# EAGLE design amiga-akab (EAGLE 7.5.0)
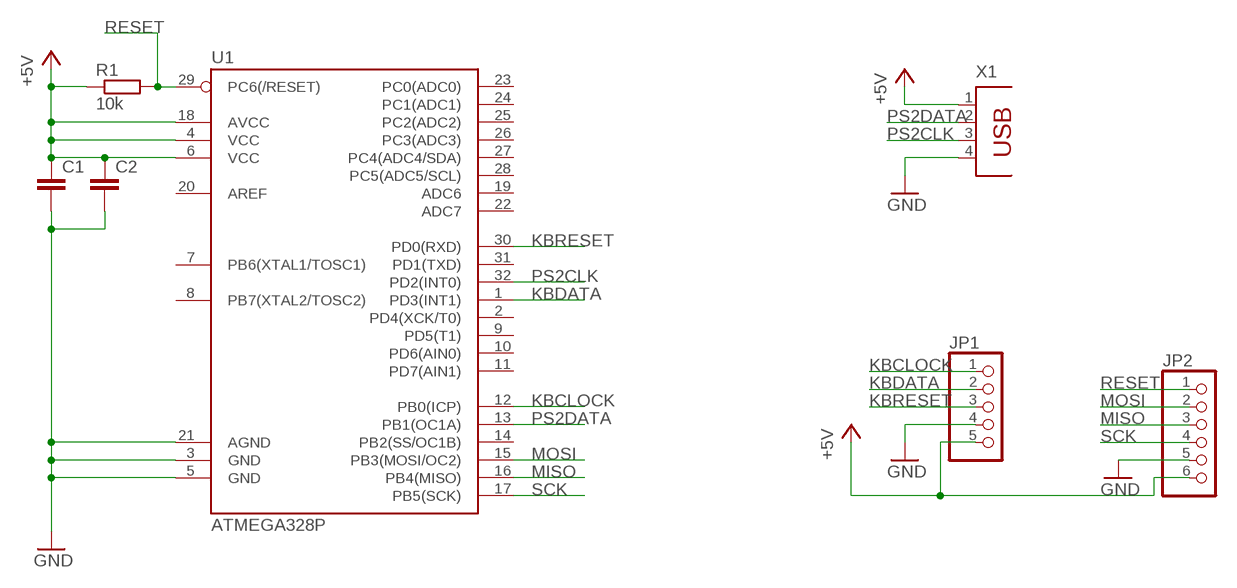
[diagram p0: schematic, sheet 1]

## Parts
C1  C-EUC0603  [C0603]
C2  C-EUC0603  [C0603]
JP1  HEADER-1X5ROUND  [1X05_ROUND]
JP2  HEADER-1X6ROUND  [1X06_ROUND]
R1  10k  R-EU_R0603  [R0603]
U1  ATMEGA328P  ATMEGA328P_TQFP  [TQFP32-08]
X1  PN87520  [PN87520]

## Nets
+5V: C1.1 C2.1 JP1.5 JP2.6 R1.1 U1.4(VCC) U1.6(VCC) U1.18(AVCC) X1.1
GND: C1.2 C2.2 JP1.4 JP2.5 U1.3(GND) U1.5(GND) U1.21(AGND) X1.4
KBCLOCK: JP1.1 U1.12(PB0(ICP))
KBDATA: JP1.2 U1.1(PD3(INT1))
KBRESET: JP1.3 U1.30(PD0(RXD))
MISO: JP2.3 U1.16(PB4(MISO))
MOSI: JP2.2 U1.15(PB3(MOSI/OC2))
PS2CLK: U1.32(PD2(INT0)) X1.3
PS2DATA: U1.13(PB1(OC1A)) X1.2
RESET: JP2.1 R1.2 U1.29(PC6(/RESET))
SCK: JP2.4 U1.17(PB5(SCK))
Unconnected: U1.2(PD4(XCK/T0)) U1.7(PB6(XTAL1/TOSC1)) U1.8(PB7(XTAL2/TOSC2)) U1.9(PD5(T1)) U1.10(PD6(AIN0)) U1.11(PD7(AIN1)) U1.14(PB2(SS/OC1B)) U1.19(ADC6) U1.20(AREF) U1.22(ADC7) U1.23(PC0(ADC0)) U1.24(PC1(ADC1)) U1.25(PC2(ADC2)) U1.26(PC3(ADC3)) U1.27(PC4(ADC4/SDA)) U1.28(PC5(ADC5/SCL)) U1.31(PD1(TXD))

## Library data of the parts
C1 C2 = resistor:C-EU: CAPACITOR, European symbol
JP1 = microbuilder:HEADER-1X5: PIN HEADER
JP2 = microbuilder:HEADER-1X6: PIN HEADER
R1 = resistor:R-EU_: RESISTOR, European symbol
U1 = SparkFun-IC-Microcontroller:ATMEGA328P_TQFP: Popular 328P in QFP Storefront component: ATmega328 - TQFP <https://www.sparkfun.com/products/13448> (COM-13448) Datasheet <http://www.sparkfun.com/datasheets/Components/SMD/ATMega328.pdf> SparkFun Products SparkFun RedBoard - Programmed with Arduino <https://www.sparkfun.com/products/12757> (DEV-12757) Arduino Pro Mini 328 - 5V/16MHz <https://www.sparkfun.com/products/11113> (DEV-11113) Arduino Pro Mini 328 - 3.3V/8MHz <https://www.sparkfun.com/products/11114> (DEV-11114) SparkFun OpenLog <https://www.sparkfun.com/products/13712> (DEV-13712) SparkFun MicroView - OLED Arduino Module <https://www.sparkfun.com/products/12923> (DEV-12923) SparkFun Digital Sandbox <https://www.sparkfun.com/products/12651> (DEV-12651) SparkFun PicoBoard <https://www.sparkfun.com/products/11888> (WIG-11888) Arduino Fio <https://www.sparkfun.com/products/10116> (DEV-10116) LilyPad Arduino 328 Main Board <https://www.sparkfun.com/products/13342> (DEV-13342) SparkFun RedStick <https://www.sparkfun.com/products/13741> (DEV-13741) LilyPad MP3 <https://www.sparkfun.com/products/11013> (DEV-11013) LilyPad Arduino SimpleSnap <https://www.sparkfun.com/products/10941> (DEV-10941) SparkFun Stepoko <https://www.sparkfun.com/products/13899> (ROB-13899) SparkFun Geiger Counter <https://www.sparkfun.com/products/11345> (SEN-11345) SparkFun EL Sequencer <https://www.sparkfun.com/products/12781> (COM-12781) Arduino Pro 328 - 5V/16MHz <https://www.sparkfun.com/products/10915> (DEV-10915) CryptoCape <https://www.sparkfun.com/products/12773> (DEV-12773) SparkFun IR Thermometer Evaluation Board - MLX90614 <https://www.sparkfun.com/products/10740> (SEN-10740) SparkFun RedBot Mainboard <https://www.sparkfun.com/products/12097> (ROB-12097) Arduino Pro 328 - 3.3V/8MHz <https://www.sparkfun.com/products/10914> (DEV-10914) SparkFun Block for Intel® Edison - Arduino <https://www.sparkfun.com/products/13036> (DEV-13036) SparkFun Simon Says - Surface Mount Soldering Kit <https://www.sparkfun.com/products/10935> (KIT-10935) SparkFun 7-Segment Serial Display - Red <https://www.sparkfun.com/products/11441> (COM-11441) SparkFun 7-Segment Serial Display - White <https://www.sparkfun.com/products/11629> (COM-11629) SparkFun 7-Segment Serial Display - Yellow <https://www.sparkfun.com/products/11443> (COM-11443) SparkFun 7-Segment Serial Display - Kelly Green <https://www.sparkfun.com/products/11440> (COM-11440) SparkFun 7-Segment Serial Display - Blue <https://www.sparkfun.com/products/11442> (COM-11442) SparkFun OpenSegment Serial Display - 20mm (Blue) <https://www.sparkfun.com/products/11647> (COM-11647) SparkFun OpenSegment Serial Display - 20mm (Green) <https://www.sparkfun.com/products/11646> (COM-11646) SparkFun OpenSegment Serial Display - 20mm (White) <https://www.sparkfun.com/products/11648> (COM-11648) SparkFun OpenSegment Serial Display - 20mm (Red) <https://www.sparkfun.com/products/11644> (COM-11644) SparkFun OpenSegment Serial Display - 20mm (Yellow) <https://www.sparkfun.com/products/11645> (COM-11645) SparkFun OpenSegment Shield <https://www.sparkfun.com/products/13190> (DEV-13190); PROD_ID: IC-09069; VALUE: ATMEGA328P_TQFP
X1 = con-berg:PN87520: BERG USB connector; OC_FARNELL: unknown; OC_NEWARK: unknown

## Board
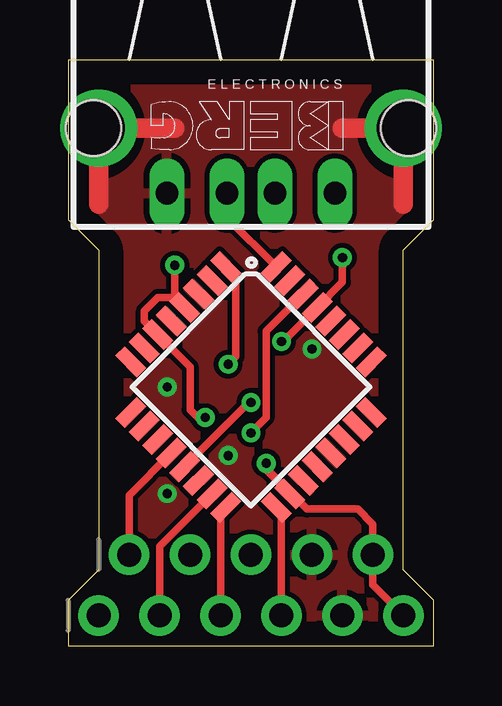
[diagram p1: board, top side]
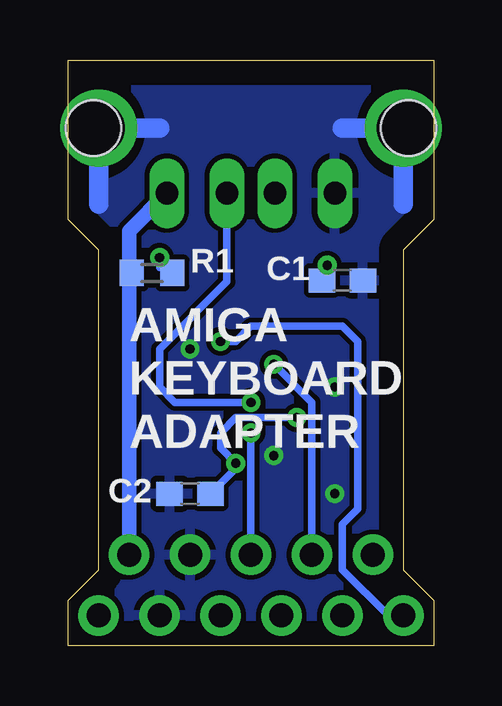
[diagram p2: board, bottom side, seen from below]

Size 15.24 x 24.43 mm. Coordinates in mm from the lower left corner, seen from the top.
Outline: 0,0 15.24,0 15.24,1.91 13.97,3.17 13.97,16.51 15.24,17.78 15.24,24.43 0,24.43 0,17.78 1.27,16.51 1.27,3.17 0,1.91 0,0
Copper layers (1*16): Top 0.035mm / dielectric 1.5mm / Bottom 0.035mm
Design rules "default": minimum track width 10mil, minimum drill 24mil, track to track 8mil, track to pad 8mil, pad to pad 8mil, via to via 8mil, smd to smd 8mil, copper to edge 40mil, drill to drill 8mil, minimum pad ring 10mil, minimum via ring 8mil, stop-mask expansion 4mil, vias tented up to drill 0mil, thermal gap 10mil

### Footprints (pad centres in the part's own frame; a part is rotated, then mirrored left to right if it is on the bottom)
C0603 = smd 1.1 x 1: 1 -0.85,0; 2 0.85,0
1X05_ROUND = drill 1 pad 1.676: 1 -5.08,0; 2 -2.54,0; 3 0,0; 4 2.54,0; 5 5.08,0
1X06_ROUND = drill 1 pad 1.676: 1 -6.35,0; 2 -3.81,0; 3 -1.27,0; 4 1.27,0; 5 3.81,0; 6 6.35,0
R0603 = smd 1 x 1.1: 1 -0.85,0; 2 0.85,0
TQFP32-08 = smd 1.27 x 0.559: 1 -4.293,2.8; 2 -4.293,2; 3 -4.293,1.2; 4 -4.293,0.4; 5 -4.293,-0.4; 6 -4.293,-1.2; 7 -4.293,-2; 8 -4.293,-2.8; 17 4.293,-2.8; 18 4.293,-2; 19 4.293,-1.2; 20 4.293,-0.4; 21 4.293,0.4; 22 4.293,1.2; 23 4.293,2; 24 4.293,2.8 | smd 0.559 x 1.27: 9 -2.8,-4.293; 10 -2,-4.293; 11 -1.2,-4.293; 12 -0.4,-4.293; 13 0.4,-4.293; 14 1.2,-4.293; 15 2,-4.293; 16 2.8,-4.293; 25 2.8,4.293; 26 2,4.293; 27 1.2,4.293; 28 0.4,4.293; 29 -0.4,4.293; 30 -1.2,4.293; 31 -2,4.293; 32 -2.8,4.293
PN87520 = drill 0.95 long: 1 -3.5,2.71; 2 -1,2.71; 3 1,2.71; 4 3.5,2.71 | hole 2.3: -6.57,0; 6.57,0

### Placement (x,y rotation side)
C1  3.81,15.24 0 bottom
C2  10.16,6.35 180 bottom
JP1  7.62,3.81 0 top
JP2  7.62,1.27 0 top
R1  11.75,15.56 0 bottom
U1  7.62,10.79 315 top
X1  7.62,21.59 180 top

### Tracks (layer width: path | path; a pad name or v marks a point on that pad's centre or on a via)
+5V  (via drill 0.38)
  Top 0.305: JP2.6 12.7,2.54 JP1.5 12.7,5.08 12.06,5.71 9.95,5.71 8.26,7.41 v8.26,7.62 8.26,7.33 U1.18 | U1.4 4.45,14.54 | 4.45,14.54 v4.45,15.88 | v5.71,9.53 5.4,9.53 5.08,9.84 5.08,11.64 U1.6 3.17,13.54 3.17,13.97 3.74,14.54 4.45,14.54
  Bottom 0.305: C2.1 8.26,7.41 v8.26,7.62 8.89,8.26 8.89,8.89 8.26,9.53 v5.71,9.53 | v4.45,15.88 4.66,15.66 C1.1 | R1.1 12.7,15.24
  Bottom 0.61: JP1.5 12.7,15.24 12.7,17.3 X1.1
GND  (via drill 0.38, 2.2)
  Top 0.813: 4.45,21.59 v1.27,21.59 1.27,18.41 | 11.43,21.59 v13.97,21.59 13.97,18.41
  Bottom 0.813: 3.81,21.59 v1.27,21.59 1.27,18.41 | 11.43,21.59 v13.97,21.59 13.97,18.41
  other vias: 6.67,7.94 10.16,12.38 4.13,6.35 4.13,10.79
  pour Top (isolate 0.038): 0,24.77 15.24,24.77 15.24,0 0,0
  pour Bottom (isolate 0.038): 0,24.77 15.24,24.77 15.24,0 0,0
KBCLOCK
  Top 0.305: U1.12 2.54,6.28 JP1.1
KBDATA  (via drill 0.38)
  Top 0.305: U1.1 6.99,15.39 6.99,12.06 v6.67,11.75
  Bottom 0.305: v6.67,11.75 5.08,10.16 JP1.2
KBRESET  (via drill 0.38)
  Top 0.305: U1.30 8.26,13.13 8.26,9.53 v7.62,8.89
  Bottom 0.305: v7.62,8.89 JP1.3
MISO
  Top 0.305: U1.16 6.35,5.57 JP2.3
MOSI
  Top 0.305: U1.15 3.81,4.16 JP2.2
PS2CLK
  Top 0.305: U1.32 6.62,17.87 X1.3
PS2DATA  (via drill 0.38)
  Top 0.305: U1.13 7.62,10.23 v7.62,10.16
  Bottom 0.305: v7.62,10.16 10.79,10.16 11.43,10.79 11.43,12.38 8.62,15.19 X1.2
RESET  (via drill 0.38)
  Top 0.305: v8.89,12.7 9.21,12.95 U1.29 11.43,15.17 v11.43,16.19
  Bottom 0.305: v8.89,12.7 8.26,12.7 7.62,13.34 3.81,13.34 3.17,12.7 3.17,5.71 3.81,5.08 3.81,3.17 1.91,1.27 JP2.1 | v11.43,16.19 11.43,15.77 R1.2
SCK
  Top 0.305: U1.17 8.89,5.57 JP2.4

### Text on the board
bNames: AMIGA | KEYBOARD | ADAPTER